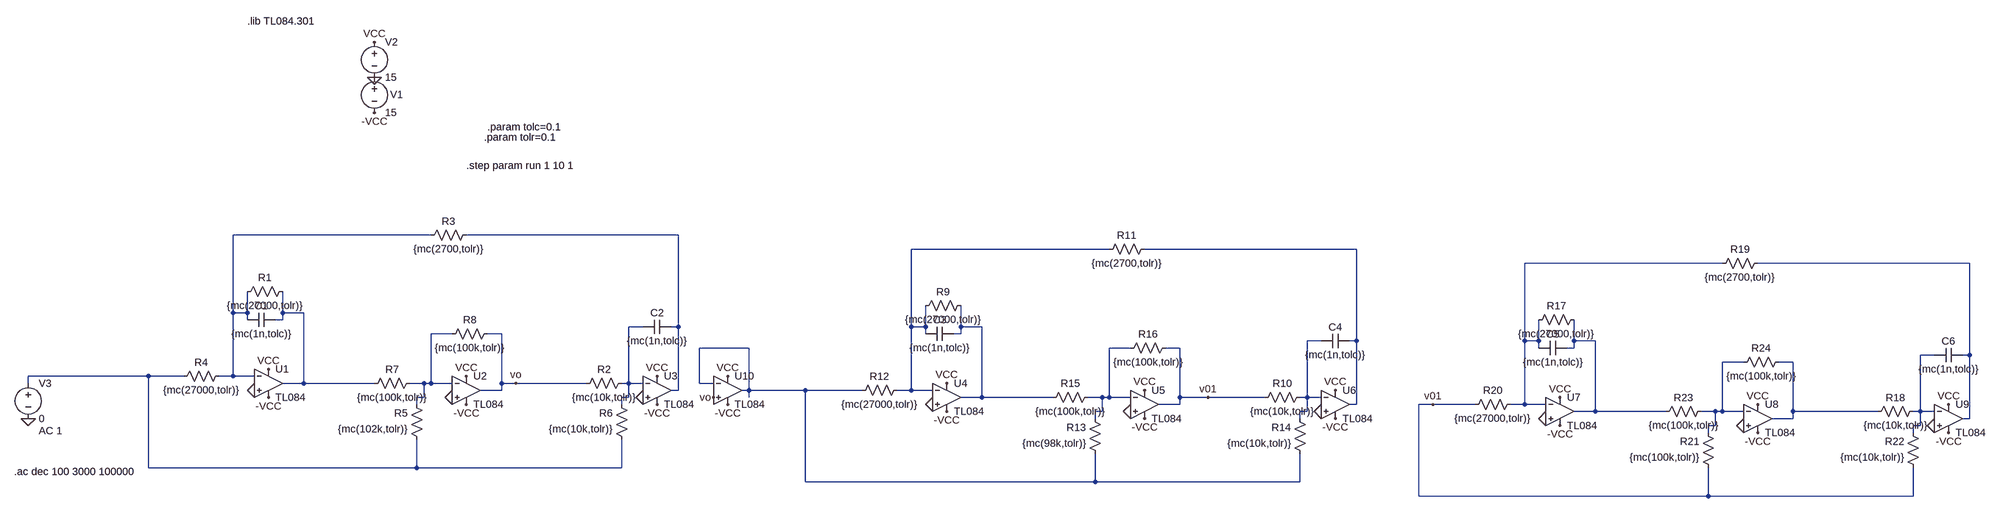
[diagram p0: schematic CEKL.asc]
CEKL.asc, the LTspice schematic file:
Version 4
SHEET 1 4184 824
WIRE 656 224 208 224
WIRE 1216 224 736 224
WIRE 2192 256 1744 256
WIRE 2752 256 2272 256
WIRE 3584 288 3136 288
WIRE 4144 288 3664 288
WIRE 208 400 208 224
WIRE 240 400 240 352
WIRE 240 400 208 400
WIRE 320 400 320 352
WIRE 368 400 320 400
WIRE 240 416 240 400
WIRE 320 416 320 400
WIRE 320 416 304 416
WIRE 1136 432 1104 432
WIRE 1216 432 1216 224
WIRE 1216 432 1200 432
WIRE 1744 432 1744 256
WIRE 1776 432 1776 384
WIRE 1776 432 1744 432
WIRE 1856 432 1856 384
WIRE 1904 432 1856 432
WIRE 704 448 656 448
WIRE 816 448 784 448
WIRE 1776 448 1776 432
WIRE 1856 448 1856 432
WIRE 1856 448 1840 448
WIRE 2672 464 2640 464
WIRE 2752 464 2752 256
WIRE 2752 464 2736 464
WIRE 3136 464 3136 288
WIRE 3168 464 3168 416
WIRE 3168 464 3136 464
WIRE 3248 464 3248 416
WIRE 3296 464 3248 464
WIRE 1376 480 1264 480
WIRE 2240 480 2192 480
WIRE 2352 480 2320 480
WIRE 3168 480 3168 464
WIRE 3248 480 3248 464
WIRE 3248 480 3232 480
WIRE 4064 496 4032 496
WIRE 4144 496 4144 288
WIRE 4144 496 4128 496
WIRE 3632 512 3584 512
WIRE 3744 512 3712 512
WIRE 16 544 -256 544
WIRE 96 544 16 544
WIRE 208 544 208 400
WIRE 208 544 176 544
WIRE 256 544 208 544
WIRE -256 560 -256 544
WIRE 368 560 368 400
WIRE 368 560 320 560
WIRE 528 560 368 560
WIRE 640 560 608 560
WIRE 656 560 656 448
WIRE 656 560 640 560
WIRE 704 560 656 560
WIRE 816 560 816 448
WIRE 848 560 816 560
WIRE 1008 560 848 560
WIRE 1104 560 1104 432
WIRE 1104 560 1088 560
WIRE 1136 560 1104 560
WIRE 1264 560 1264 480
WIRE 1296 560 1264 560
WIRE 816 576 816 560
WIRE 816 576 768 576
WIRE 1216 576 1216 432
WIRE 1216 576 1200 576
WIRE 1376 576 1376 480
WIRE 1376 576 1360 576
WIRE 1504 576 1376 576
WIRE 1632 576 1504 576
WIRE 1744 576 1744 432
WIRE 1744 576 1712 576
WIRE 1792 576 1744 576
WIRE 640 592 640 560
WIRE 640 592 624 592
WIRE 1104 592 1104 560
WIRE 1104 592 1088 592
WIRE 1376 592 1376 576
WIRE 1904 592 1904 432
WIRE 1904 592 1856 592
WIRE 2064 592 1904 592
WIRE 2176 592 2144 592
WIRE 2192 592 2192 480
WIRE 2192 592 2176 592
WIRE 2240 592 2192 592
WIRE 2352 592 2352 480
WIRE 2416 592 2352 592
WIRE 2544 592 2416 592
WIRE 2640 592 2640 464
WIRE 2640 592 2624 592
WIRE 2672 592 2640 592
WIRE 624 608 624 592
WIRE 1088 608 1088 592
WIRE 2352 608 2352 592
WIRE 2352 608 2304 608
WIRE 2752 608 2752 464
WIRE 2752 608 2736 608
WIRE 2928 608 2896 608
WIRE 3024 608 2928 608
WIRE 3136 608 3136 464
WIRE 3136 608 3104 608
WIRE 3184 608 3136 608
WIRE 2176 624 2176 592
WIRE 2176 624 2160 624
WIRE 2640 624 2640 592
WIRE 2640 624 2624 624
WIRE 3296 624 3296 464
WIRE 3296 624 3248 624
WIRE 3456 624 3296 624
WIRE 3568 624 3536 624
WIRE 3584 624 3584 512
WIRE 3584 624 3568 624
WIRE 3632 624 3584 624
WIRE 3744 624 3744 512
WIRE 3936 624 3744 624
WIRE 4032 624 4032 496
WIRE 4032 624 4016 624
WIRE 4064 624 4032 624
WIRE 2160 640 2160 624
WIRE 2624 640 2624 624
WIRE 3744 640 3744 624
WIRE 3744 640 3696 640
WIRE 4144 640 4144 496
WIRE 4144 640 4128 640
WIRE 3568 656 3568 624
WIRE 3568 656 3552 656
WIRE 4032 656 4032 624
WIRE 4032 656 4016 656
WIRE 3552 672 3552 656
WIRE 4016 672 4016 656
WIRE 16 752 16 544
WIRE 624 752 624 688
WIRE 624 752 16 752
WIRE 1088 752 1088 688
WIRE 1088 752 624 752
WIRE 1504 784 1504 576
WIRE 2160 784 2160 720
WIRE 2160 784 1504 784
WIRE 2624 784 2624 720
WIRE 2624 784 2160 784
WIRE 2896 816 2896 608
WIRE 3552 816 3552 752
WIRE 3552 816 2896 816
WIRE 4016 816 4016 752
WIRE 4016 816 3552 816
FLAG 288 528 VCC
FLAG 528 -272 VCC
FLAG 288 592 -VCC
FLAG 528 -112 -VCC
FLAG 528 -192 0
FLAG 256 576 0
FLAG -256 640 0
FLAG 736 544 VCC
FLAG 736 608 -VCC
FLAG 704 592 0
FLAG 1168 544 VCC
FLAG 1168 608 -VCC
FLAG 1136 592 0
FLAG 848 560 vo
FLAG 1824 560 VCC
FLAG 1824 624 -VCC
FLAG 1792 608 0
FLAG 2272 576 VCC
FLAG 2272 640 -VCC
FLAG 2240 624 0
FLAG 2704 576 VCC
FLAG 2704 640 -VCC
FLAG 2672 624 0
FLAG 3216 592 VCC
FLAG 3216 656 -VCC
FLAG 3184 640 0
FLAG 3664 608 VCC
FLAG 3664 672 -VCC
FLAG 3632 656 0
FLAG 4096 608 VCC
FLAG 4096 672 -VCC
FLAG 4064 656 0
FLAG 2416 592 v01
FLAG 2928 608 v01
FLAG 1328 544 VCC
FLAG 1328 608 -VCC
FLAG 1296 592 vo
SYMBOL Opamps\\opamp2 288 496 R0
SYMATTR InstName U1
SYMATTR Value TL084
SYMBOL voltage 528 -208 R0
WINDOW 0 36 55 Left 2
WINDOW 123 0 0 Left 2
WINDOW 39 0 0 Left 2
SYMATTR InstName V1
SYMATTR Value 15
SYMBOL voltage 528 -288 R0
WINDOW 123 0 0 Left 2
WINDOW 39 0 0 Left 2
SYMATTR InstName V2
SYMATTR Value 15
SYMBOL voltage -256 544 R0
WINDOW 123 24 124 Left 2
WINDOW 39 0 0 Left 2
SYMATTR Value2 AC 1
SYMATTR InstName V3
SYMATTR Value 0
SYMBOL Opamps\\opamp2 736 512 R0
SYMATTR InstName U2
SYMATTR Value TL084
SYMBOL Opamps\\opamp2 1168 512 R0
SYMATTR InstName U3
SYMATTR Value TL084
SYMBOL res 336 336 R90
WINDOW 0 0 56 VBottom 2
WINDOW 3 32 56 VTop 2
SYMATTR InstName R1
SYMATTR Value {mc(27000,tolr)}
SYMBOL res 1104 544 R90
WINDOW 0 0 56 VBottom 2
WINDOW 3 32 56 VTop 2
SYMATTR InstName R2
SYMATTR Value {mc(10k,tolr)}
SYMBOL res 752 208 R90
WINDOW 0 0 56 VBottom 2
WINDOW 3 32 56 VTop 2
SYMATTR InstName R3
SYMATTR Value {mc(2700,tolr)}
SYMBOL res 192 528 R90
WINDOW 0 0 56 VBottom 2
WINDOW 3 32 56 VTop 2
SYMATTR InstName R4
SYMATTR Value {mc(27000,tolr)}
SYMBOL res 640 704 R180
WINDOW 0 36 76 Left 2
WINDOW 3 36 40 Left 2
SYMATTR InstName R5
SYMATTR Value {mc(102k,tolr)}
SYMBOL res 1104 704 R180
WINDOW 0 36 76 Left 2
WINDOW 3 36 40 Left 2
SYMATTR InstName R6
SYMATTR Value {mc(10k,tolr)}
SYMBOL res 512 576 R270
WINDOW 0 32 56 VTop 2
WINDOW 3 0 56 VBottom 2
SYMATTR InstName R7
SYMATTR Value {mc(100k,tolr)}
SYMBOL res 688 464 R270
WINDOW 0 32 56 VTop 2
WINDOW 3 0 56 VBottom 2
SYMATTR InstName R8
SYMATTR Value {mc(100k,tolr)}
SYMBOL cap 304 400 R90
WINDOW 0 0 32 VBottom 2
WINDOW 3 32 32 VTop 2
SYMATTR InstName C1
SYMATTR Value {mc(1n,tolc)}
SYMBOL cap 1200 416 R90
WINDOW 0 0 32 VBottom 2
WINDOW 3 32 32 VTop 2
SYMATTR InstName C2
SYMATTR Value {mc(1n,tolc)}
SYMBOL Opamps\\opamp2 1824 528 R0
SYMATTR InstName U4
SYMATTR Value TL084
SYMBOL Opamps\\opamp2 2272 544 R0
SYMATTR InstName U5
SYMATTR Value TL084
SYMBOL Opamps\\opamp2 2704 544 R0
SYMATTR InstName U6
SYMATTR Value TL084
SYMBOL res 1872 368 R90
WINDOW 0 0 56 VBottom 2
WINDOW 3 32 56 VTop 2
SYMATTR InstName R9
SYMATTR Value {mc(27000,tolr)}
SYMBOL res 2640 576 R90
WINDOW 0 0 56 VBottom 2
WINDOW 3 32 56 VTop 2
SYMATTR InstName R10
SYMATTR Value {mc(10k,tolr)}
SYMBOL res 2288 240 R90
WINDOW 0 0 56 VBottom 2
WINDOW 3 32 56 VTop 2
SYMATTR InstName R11
SYMATTR Value {mc(2700,tolr)}
SYMBOL res 1728 560 R90
WINDOW 0 0 56 VBottom 2
WINDOW 3 32 56 VTop 2
SYMATTR InstName R12
SYMATTR Value {mc(27000,tolr)}
SYMBOL res 2176 736 R180
WINDOW 0 36 76 Left 2
WINDOW 3 36 40 Left 2
SYMATTR InstName R13
SYMATTR Value {mc(98k,tolr)}
SYMBOL res 2640 736 R180
WINDOW 0 36 76 Left 2
WINDOW 3 36 40 Left 2
SYMATTR InstName R14
SYMATTR Value {mc(10k,tolr)}
SYMBOL res 2048 608 R270
WINDOW 0 32 56 VTop 2
WINDOW 3 0 56 VBottom 2
SYMATTR InstName R15
SYMATTR Value {mc(100k,tolr)}
SYMBOL res 2224 496 R270
WINDOW 0 32 56 VTop 2
WINDOW 3 0 56 VBottom 2
SYMATTR InstName R16
SYMATTR Value {mc(100k,tolr)}
SYMBOL cap 1840 432 R90
WINDOW 0 0 32 VBottom 2
WINDOW 3 32 32 VTop 2
SYMATTR InstName C3
SYMATTR Value {mc(1n,tolc)}
SYMBOL cap 2736 448 R90
WINDOW 0 0 32 VBottom 2
WINDOW 3 32 32 VTop 2
SYMATTR InstName C4
SYMATTR Value {mc(1n,tolc)}
SYMBOL Opamps\\opamp2 3216 560 R0
SYMATTR InstName U7
SYMATTR Value TL084
SYMBOL Opamps\\opamp2 3664 576 R0
SYMATTR InstName U8
SYMATTR Value TL084
SYMBOL Opamps\\opamp2 4096 576 R0
SYMATTR InstName U9
SYMATTR Value TL084
SYMBOL res 3264 400 R90
WINDOW 0 0 56 VBottom 2
WINDOW 3 32 56 VTop 2
SYMATTR InstName R17
SYMATTR Value {mc(27000,tolr)}
SYMBOL res 4032 608 R90
WINDOW 0 0 56 VBottom 2
WINDOW 3 32 56 VTop 2
SYMATTR InstName R18
SYMATTR Value {mc(10k,tolr)}
SYMBOL res 3680 272 R90
WINDOW 0 0 56 VBottom 2
WINDOW 3 32 56 VTop 2
SYMATTR InstName R19
SYMATTR Value {mc(2700,tolr)}
SYMBOL res 3120 592 R90
WINDOW 0 0 56 VBottom 2
WINDOW 3 32 56 VTop 2
SYMATTR InstName R20
SYMATTR Value {mc(27000,tolr)}
SYMBOL res 3568 768 R180
WINDOW 0 36 76 Left 2
WINDOW 3 36 40 Left 2
SYMATTR InstName R21
SYMATTR Value {mc(100k,tolr)}
SYMBOL res 4032 768 R180
WINDOW 0 36 76 Left 2
WINDOW 3 36 40 Left 2
SYMATTR InstName R22
SYMATTR Value {mc(10k,tolr)}
SYMBOL res 3440 640 R270
WINDOW 0 32 56 VTop 2
WINDOW 3 0 56 VBottom 2
SYMATTR InstName R23
SYMATTR Value {mc(100k,tolr)}
SYMBOL res 3616 528 R270
WINDOW 0 32 56 VTop 2
WINDOW 3 0 56 VBottom 2
SYMATTR InstName R24
SYMATTR Value {mc(100k,tolr)}
SYMBOL cap 3232 464 R90
WINDOW 0 0 32 VBottom 2
WINDOW 3 32 32 VTop 2
SYMATTR InstName C5
SYMATTR Value {mc(1n,tolc)}
SYMBOL cap 4128 480 R90
WINDOW 0 0 32 VBottom 2
WINDOW 3 32 32 VTop 2
SYMATTR InstName C6
SYMATTR Value {mc(1n,tolc)}
SYMBOL Opamps\\opamp2 1328 512 R0
SYMATTR InstName U10
SYMATTR Value TL084
TEXT 240 -320 Left 2 !.lib TL084.301
TEXT 776 -56 Left 2 !.param tolr=0.1
TEXT 784 -80 Left 2 !.param tolc=0.1
TEXT 736 8 Left 2 !.step param run 1 10 1
TEXT -288 760 Left 2 !.ac dec 100 3000 100000

The netlist it stands for:
* CEKL.asc
XU1 0 N001 VCC -VCC N007 TL084  ; pins In+ In- V+ V- OUT
V1 0 -VCC 15
V2 VCC 0 15
V3 N018 0 0 AC 1
XU2 0 N010 VCC -VCC vo TL084  ; pins In+ In- V+ V- OUT
XU3 0 N008 VCC -VCC N002 TL084  ; pins In+ In- V+ V- OUT
R1 N007 N001 {mc(27000,tolr)}
R2 N008 vo {mc(10k,tolr)}
R3 N002 N001 {mc(2700,tolr)}
R4 N001 N018 {mc(27000,tolr)}
R5 N018 N010 {mc(102k,tolr)}
R6 N018 N008 {mc(10k,tolr)}
R7 N007 N010 {mc(100k,tolr)}
R8 N010 vo {mc(100k,tolr)}
C1 N007 N001 {mc(1n,tolc)}
C2 N002 N008 {mc(1n,tolc)}
XU4 0 N003 VCC -VCC N009 TL084  ; pins In+ In- V+ V- OUT
XU5 0 N014 VCC -VCC v01 TL084  ; pins In+ In- V+ V- OUT
XU6 0 N011 VCC -VCC N004 TL084  ; pins In+ In- V+ V- OUT
R9 N009 N003 {mc(27000,tolr)}
R10 N011 v01 {mc(10k,tolr)}
R11 N004 N003 {mc(2700,tolr)}
R12 N003 N013 {mc(27000,tolr)}
R13 N013 N014 {mc(98k,tolr)}
R14 N013 N011 {mc(10k,tolr)}
R15 N009 N014 {mc(100k,tolr)}
R16 N014 v01 {mc(100k,tolr)}
C3 N009 N003 {mc(1n,tolc)}
C4 N004 N011 {mc(1n,tolc)}
XU7 0 N005 VCC -VCC N012 TL084  ; pins In+ In- V+ V- OUT
XU8 0 N016 VCC -VCC N017 TL084  ; pins In+ In- V+ V- OUT
XU9 0 N015 VCC -VCC N006 TL084  ; pins In+ In- V+ V- OUT
R17 N012 N005 {mc(27000,tolr)}
R18 N015 N017 {mc(10k,tolr)}
R19 N006 N005 {mc(2700,tolr)}
R20 N005 v01 {mc(27000,tolr)}
R21 v01 N016 {mc(100k,tolr)}
R22 v01 N015 {mc(10k,tolr)}
R23 N012 N016 {mc(100k,tolr)}
R24 N016 N017 {mc(100k,tolr)}
C5 N012 N005 {mc(1n,tolc)}
C6 N006 N015 {mc(1n,tolc)}
XU10 vo N013 VCC -VCC N013 TL084  ; pins In+ In- V+ V- OUT
.lib TL084.301
.param tolr=0.1
.param tolc=0.1
.step param run 1 10 1
.ac dec 100 3000 100000
.backanno
.end